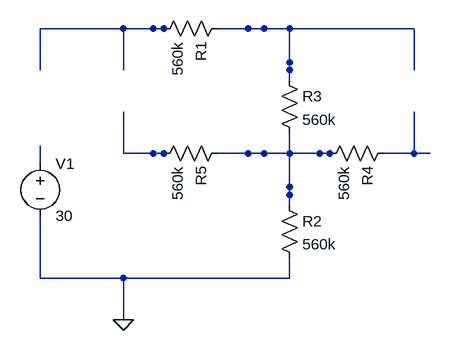
[diagram p0: schematic pannel_4.asc]
pannel_4.asc, the LTspice schematic file:
Version 4
SHEET 1 880 680
WIRE 640 528 640 500
WIRE 640 640 640 608
SYMBOL res 624 512 R0
SYMATTR InstName R2
SYMATTR Value 560k
WIRE 640 336 640 308
WIRE 640 448 640 416
SYMBOL res 624 320 R0
SYMATTR InstName R3
SYMATTR Value 560k
WIRE 528 256 601 256
WIRE 430 256 446 256
SYMBOL res 544 240 R90
SYMATTR InstName R1
SYMATTR Value 560k
WIRE 784 448 857 448
WIRE 686 448 702 448
SYMBOL res 800 432 R90
SYMATTR InstName R4
SYMATTR Value 560k
WIRE 528 448 601 448
WIRE 430 448 446 448
SYMBOL res 544 432 R90
SYMATTR InstName R5
SYMATTR Value 560k
FLAG 384 704 0
WIRE 256 464 256 436
WIRE 256 576 256 544
SYMBOL voltage 256 448 R0
SYMATTR InstName V1
SYMATTR Value 30
WIRE 640 448 704 448
WIRE 640 448 640 512
WIRE 576 448 640 448
WIRE 576 640 640 640
WIRE 256 640 320 640
WIRE 256 576 256 640
WIRE 256 256 320 256
WIRE 256 256 256 320
WIRE 640 256 704 256
WIRE 640 256 640 320
WIRE 576 256 640 256
WIRE 832 384 832 448
WIRE 832 256 832 320
WIRE 768 256 832 256
WIRE 384 448 448 448
WIRE 384 384 384 448
WIRE 384 256 448 256
WIRE 384 256 384 320
WIRE 320 256 384 256
WIRE 384 640 448 640
WIRE 384 640 384 704
WIRE 320 640 384 640
WIRE 704 256 768 256
WIRE 512 640 576 640
WIRE 448 640 512 640

The netlist it stands for:
* pannel_4.asc
R2 N001 0 560k
R3 N002 N001 560k
R1 N002 N003 560k
R4 N004 N001 560k
R5 N001 N005 560k
V1 N006 0 30
.backanno
.end